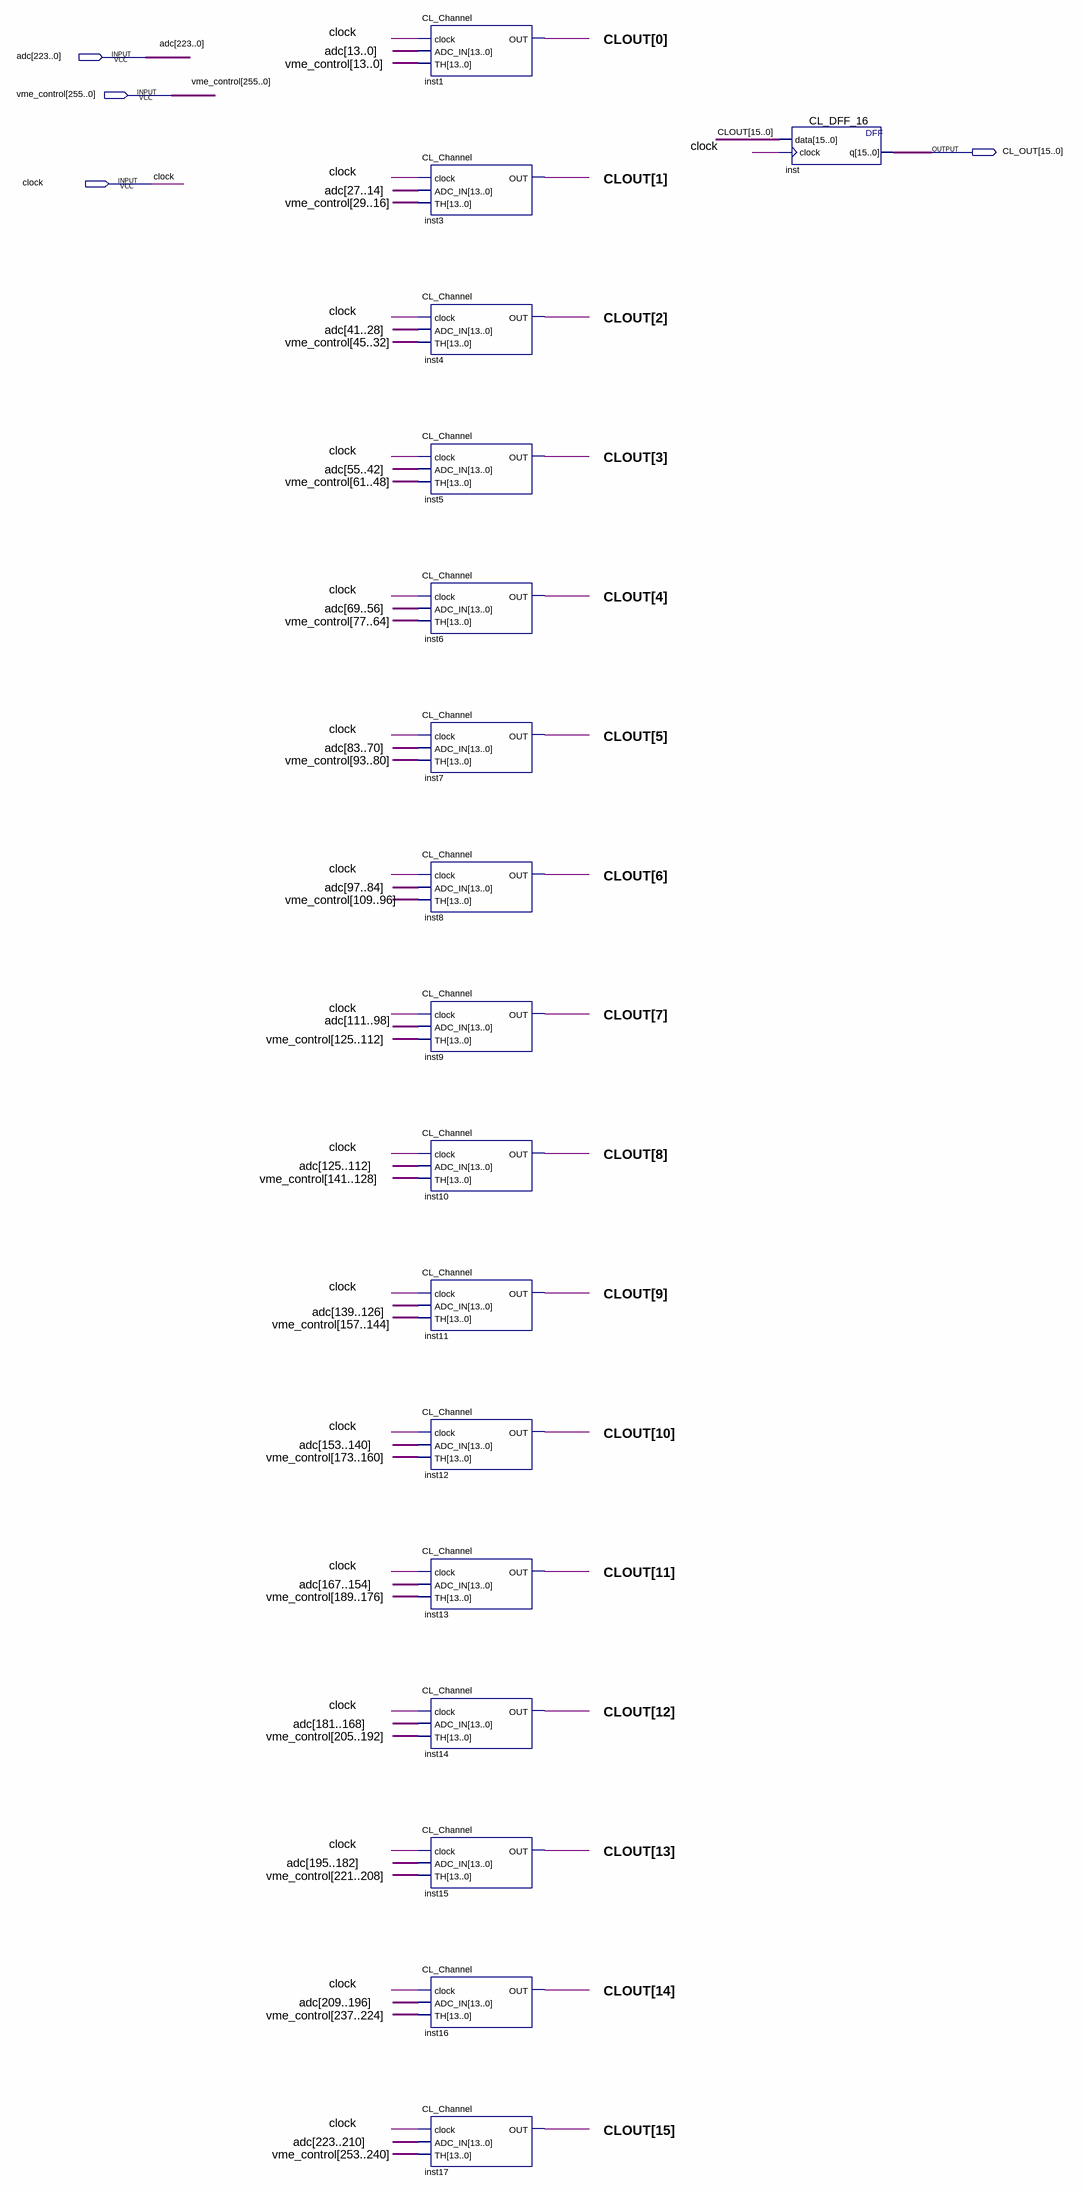
[diagram p0: schematic sheet]
// Quartus schematic CL_Block.bdf as structural Verilog: 17 symbols, 4 pins
module CL_Block (
  input  [223:0] adc,
  input  [255:0] vme_control,
  input  clock,
  output [15:0] CL_OUT
);

  wire [15:0] CLOUT;

  CL_Channel inst1 (.clock(clock), .ADC_IN(adc[13:0]), .TH(vme_control[13:0]), .OUT(CLOUT[0]));
  CL_Channel inst3 (.clock(clock), .ADC_IN(adc[27:14]), .TH(vme_control[29:16]), .OUT(CLOUT[1]));
  CL_Channel inst4 (.clock(clock), .ADC_IN(adc[41:28]), .TH(vme_control[45:32]), .OUT(CLOUT[2]));
  CL_Channel inst5 (.clock(clock), .ADC_IN(adc[55:42]), .TH(vme_control[61:48]), .OUT(CLOUT[3]));
  CL_Channel inst6 (.clock(clock), .ADC_IN(adc[69:56]), .TH(vme_control[77:64]), .OUT(CLOUT[4]));
  CL_Channel inst7 (.clock(clock), .ADC_IN(adc[83:70]), .TH(vme_control[93:80]), .OUT(CLOUT[5]));
  CL_Channel inst8 (.clock(clock), .ADC_IN(adc[97:84]), .TH(vme_control[109:96]), .OUT(CLOUT[6]));
  CL_Channel inst9 (.clock(clock), .ADC_IN(adc[111:98]), .TH(vme_control[125:112]), .OUT(CLOUT[7]));
  CL_Channel inst10 (.clock(clock), .ADC_IN(adc[125:112]), .TH(vme_control[141:128]), .OUT(CLOUT[8]));
  CL_Channel inst11 (.clock(clock), .ADC_IN(adc[139:126]), .TH(vme_control[157:144]), .OUT(CLOUT[9]));
  CL_Channel inst12 (.clock(clock), .ADC_IN(adc[153:140]), .TH(vme_control[173:160]), .OUT(CLOUT[10]));
  CL_Channel inst13 (.clock(clock), .ADC_IN(adc[167:154]), .TH(vme_control[189:176]), .OUT(CLOUT[11]));
  CL_Channel inst14 (.clock(clock), .ADC_IN(adc[181:168]), .TH(vme_control[205:192]), .OUT(CLOUT[12]));
  CL_Channel inst15 (.clock(clock), .ADC_IN(adc[195:182]), .TH(vme_control[221:208]), .OUT(CLOUT[13]));
  CL_Channel inst16 (.clock(clock), .ADC_IN(adc[209:196]), .TH(vme_control[237:224]), .OUT(CLOUT[14]));
  CL_Channel inst17 (.clock(clock), .ADC_IN(adc[223:210]), .TH(vme_control[253:240]), .OUT(CLOUT[15]));
  CL_DFF_16 inst (.data(CLOUT), .clock(clock), .q(CL_OUT));
endmodule
